# EAGLE schematic Volume_Control (EAGLE 6.3)
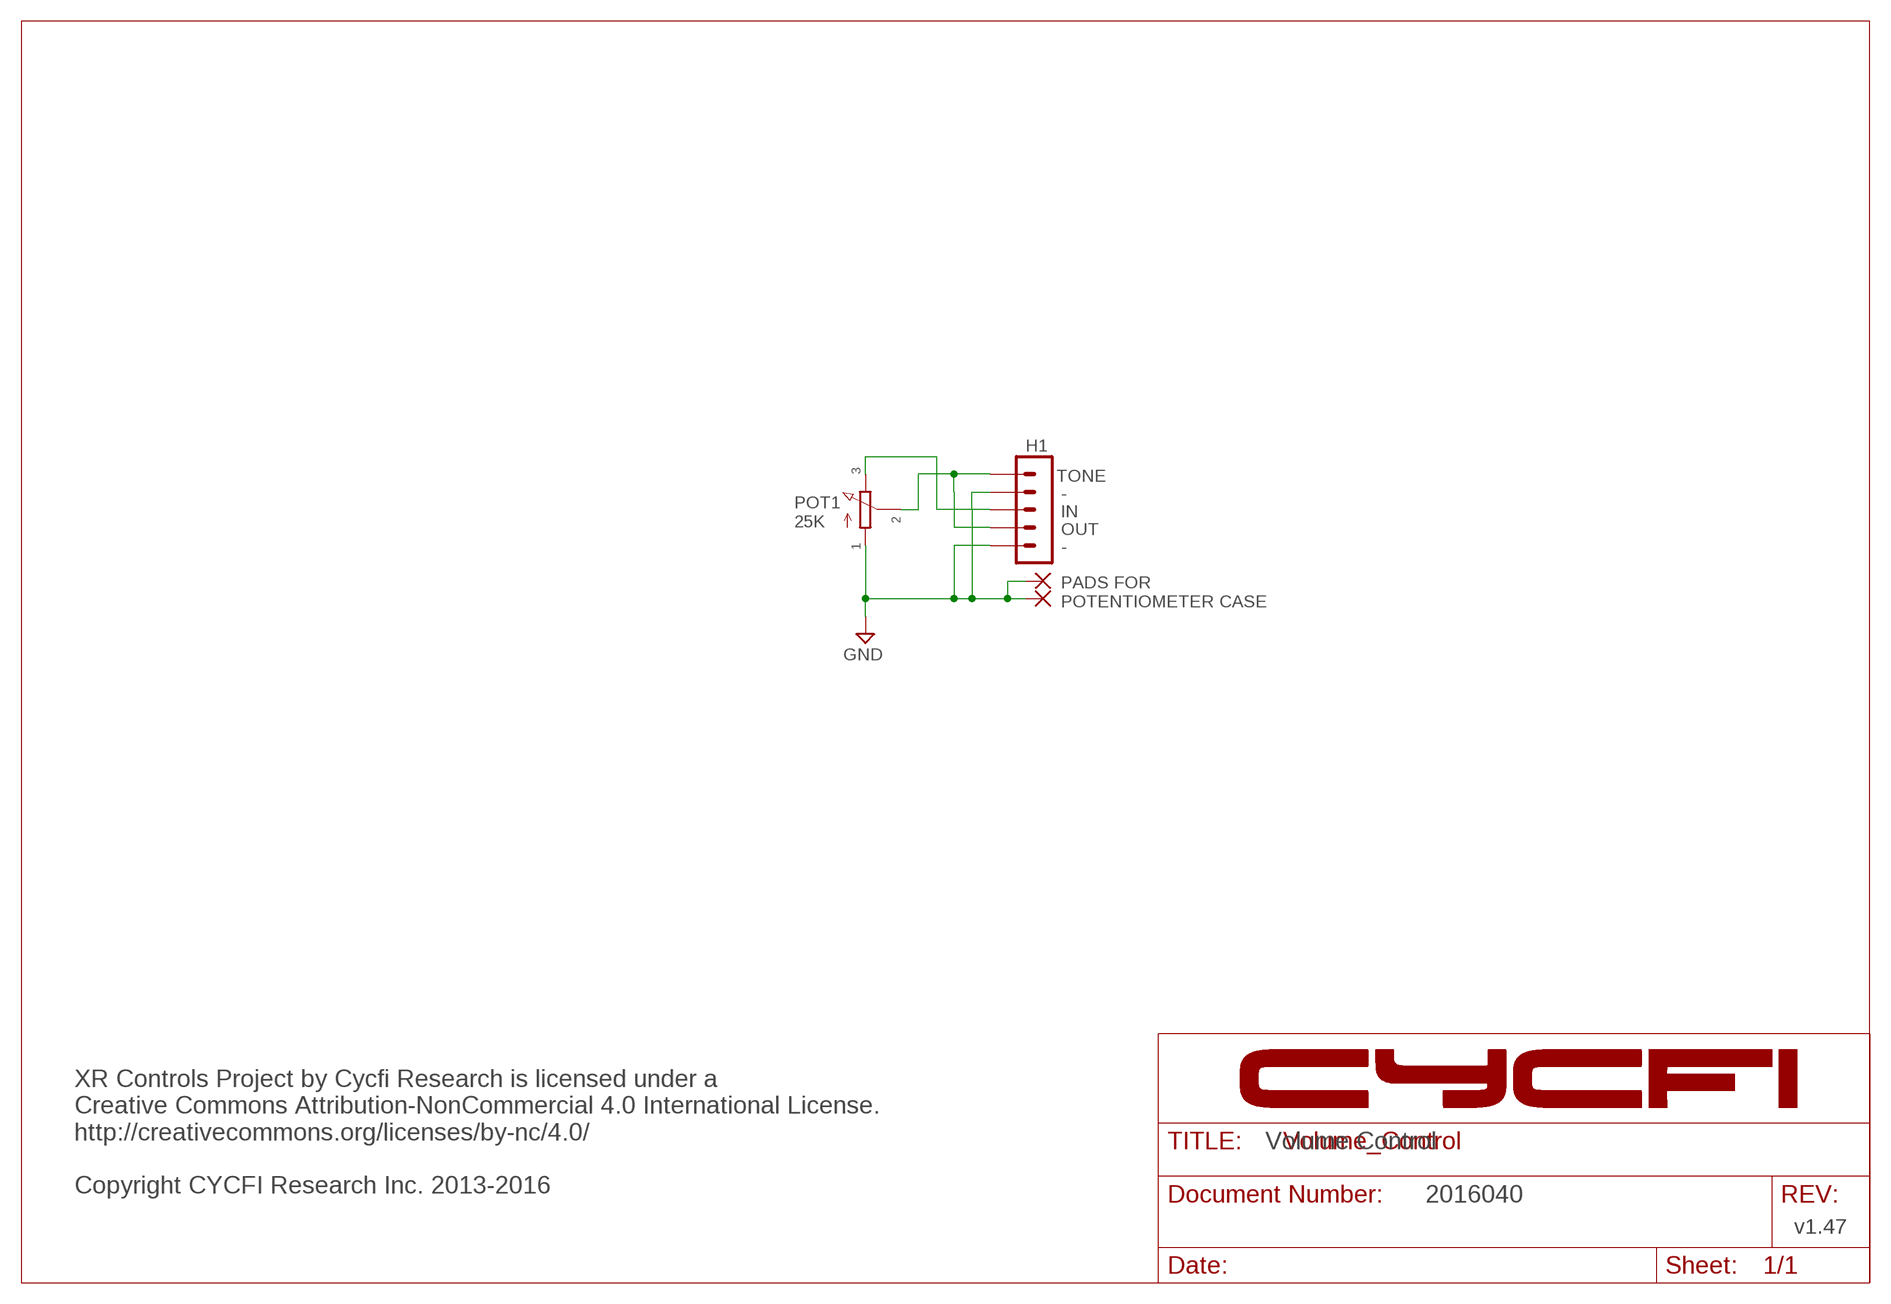
[diagram p0: schematic, sheet 1]

## Parts
GND3  SMD2  [SMD1,27-2,54]
GND4  SMD2  [SMD1,27-2,54]
H1  961105-5500-AR-PR  [5P-SMD-2.54MM]
POT1  PDB241-GTR01  [PDB241]

## Nets
GND: GND3.1(P) GND4.1(P) H1.P$1 H1.P$4 POT1.P$1
N$1: H1.P$3 POT1.P$3
N$3: H1.P$2 H1.P$5 POT1.P$2

## Notes on the sheet
- TONE
- -
- IN
- OUT
- POT1
  25K
- -
- PADS FOR 
  POTENTIOMETER CASE
- Volume Control
- XR Controls Project by Cycfi Research is licensed under a 
  Creative Commons Attribution-NonCommercial 4.0 International License. 
  http://creativecommons.org/licenses/by-nc/4.0/
  
  Copyright CYCFI Research Inc. 2013-2016
- 2016040
- v1.47

## Library data of the parts
GND3 GND4 = wirepad:SMD2: SMD PAD
H1 = CYCFI_Con:961105-5500-AR-PR
POT1 = CYCFI_Passive:PDB241-GTR01